# Altium schematic sheet General Overview.SchDoc: General Overview
size A4; Organization: Robbe's Workshop; Address1: Robbe Van Assche; Address2: Belgium; Address3: 2015; Address4: HC595 7 segment breakout; DocumentNumber: ALT0063; Revision: A; SheetNumber: 1; SheetTotal: 1
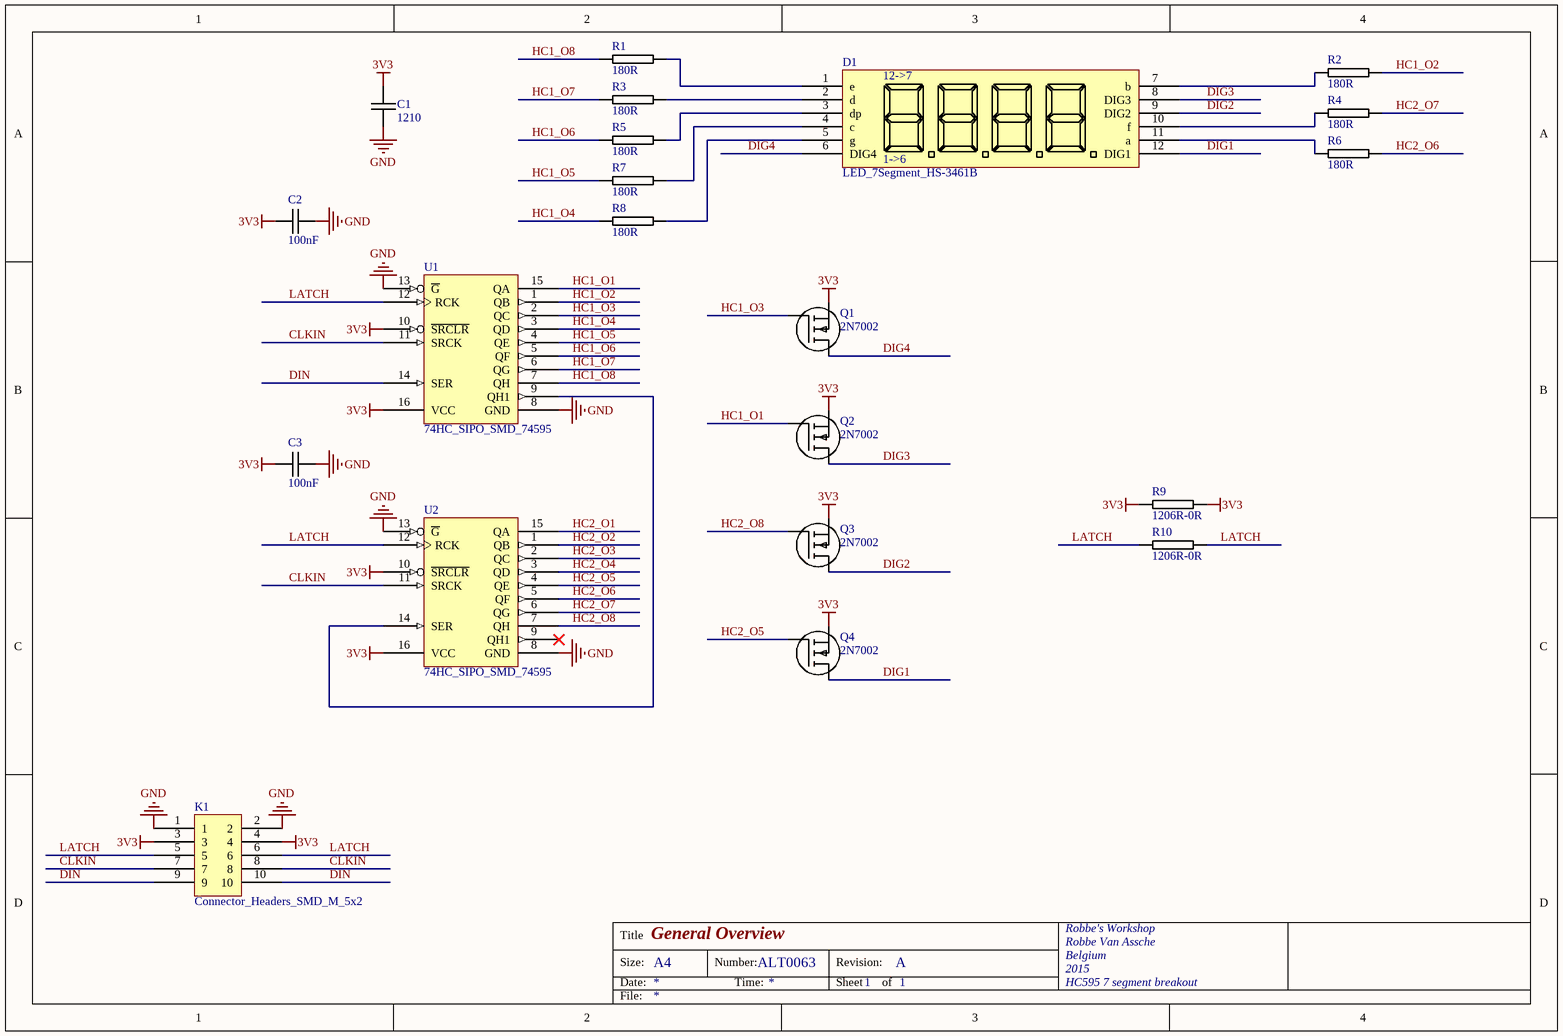
[diagram p0: General Overview.SchDoc]

## Parts
C1  1210  [1210C-GENERIC]
C2  100nF  [0805C-TBD]
C3  100nF  [0805C-TBD]
D1  LED_7Segment_HS-3461B  [HS3461]
K1  Connector_Headers_SMD_M_5x2  [Header_Male_2.54 5x2]
Q1  2N7002  [SOT23-GDS]
Q2  2N7002  [SOT23-GDS]
Q3  2N7002  [SOT23-GDS]
Q4  2N7002  [SOT23-GDS]
R1  180R  [0805R-180]
R2  180R  [0805R-180]
R3  180R  [0805R-180]
R4  180R  [0805R-180]
R5  180R  [0805R-180]
R6  180R  [0805R-180]
R7  180R  [0805R-180]
R8  180R  [0805R-180]
R9  1206R-0R  [1206R-GENERIC]
R10  1206R-0R  [1206R-GENERIC]
U1  74HC_SIPO_SMD_74595  [SO16]
U2  74HC_SIPO_SMD_74595  [SO16]

## Nets
3V3: C1.1 C2.1 C3.1 K1.3 K1.4 Q1.S Q2.S Q3.S Q4.S R9.1 R9.2 U1.10(~{SRCLR}) U1.16(VCC) U2.10(~{SRCLR}) U2.16(VCC)
GND: C1.2 C2.2 C3.2 K1.1 K1.2 U1.8(GND) U1.13(~{G}) U2.8(GND) U2.13(~{G})
CLKIN: K1.7 K1.8 U1.11(SRCK) U2.11(SRCK)
DIG1: D1.12(DIG1) Q4.D
DIG2: D1.9(DIG2) Q3.D
DIG3: D1.8(DIG3) Q2.D
DIG4: D1.6(DIG4) Q1.D
DIN: K1.9 K1.10 U1.14(SER)
HC1_O1: Q2.G U1.15(QA)
HC1_O2: R2.2 U1.1(QB)
HC1_O3: Q1.G U1.2(QC)
HC1_O4: R8.1 U1.3(QD)
HC1_O5: R7.1 U1.4(QE)
HC1_O6: R5.1 U1.5(QF)
HC1_O7: R3.1 U1.6(QG)
HC1_O8: R1.1 U1.7(QH)
HC2_O1: U2.15(QA)
HC2_O2: U2.1(QB)
HC2_O3: U2.2(QC)
HC2_O4: U2.3(QD)
HC2_O5: Q4.G U2.4(QE)
HC2_O6: R6.2 U2.5(QF)
HC2_O7: R4.2 U2.6(QG)
HC2_O8: Q3.G U2.7(QH)
LATCH: K1.5 K1.6 R10.1 R10.2 U1.12(RCK) U2.12(RCK)
NetD1_1: D1.1(e) R1.2
NetD1_2: D1.2(d) R3.2
NetD1_3: D1.3(dp) R5.2
NetD1_4: D1.4(c) R7.2
NetD1_5: D1.5(g) R8.2
NetD1_7: D1.7(b) R2.1
NetD1_10: D1.10(f) R4.1
NetD1_11: D1.11(a) R6.1
NetU1_9: U1.9(QH1) U2.14(SER)

Not connected (* = marked no-connect by the designer): U2 9(QH1)*

## Notes on the sheet
- Title
- Size:
- Date:
- A4
- Number:
- Time:
- Revision:
- Sheet
- of
- File:
- (in symbol LED_7Segment_HS-3461B) 12->7; 1->6

## Library data of the parts
C1 = Passives_Capacitors_1210_1210C-TBD: CAPACITOR 1210 CERAMIC VALUE TO BE DETERMINED
C2 C3 = Passives_Capacitors_0805_100nF-25V-X7R-MUR: CAPACITOR 0805 CERAMIC; Supplier 1: Digi-Key; Supplier Part Number 1: 490-1673-1-ND
K1 = Connector_Headers_SMD_M_5x2: SMD Header 5x2
Q1-Q4 = 2N7002-SOT23: N CHANNEL MOSFET 2N7002 SOT23; Manufacturer: Fairchild Semiconductor; Drain to Source Voltage (Vdss): 60V; Vgs(th) (Max) @ Id: 2.5V @ 250µA; Power - Max: 200mW; Current - Continuous Drain (Id) @ 25° C: 115mA; Rds On (Max) @ Id, Vgs: 7.5 Ohm @ 500mA, 10V; FET Type: MOSFET N-Channel, Metal Oxide; FET Feature: Logic Level Gate; Input Capacitance (Ciss) @ Vds: 50pF @ 25V; Reel: Q2; Supplier 1: Digi-Key; Supplier Part Number 1: 2N7002NTR-ND; Package / Case: SOT-23-3, TO-236-3, Micro3™, SSD3, SST3; RoHS: RoHS Compliant; Mounting Type: Surface Mount; Packaging: Tape & Reel (TR); Gate Charge (Qg) @ Vgs: -; Supplier Part Number: 2N7002NTR-ND; Supplier: Digi-Key; Category: Discrete Semiconductor Products; Manufacturer Part Number: 2N7002
R1-R8 = 0805R-180: RESISTOR 0805 1/4 WATT THIN FILM; Reel: *
U1 U2 = 74HC_SIPO_SMD_74595: 8-BIT SFT REG WIRTH OUTPUT LCH